# EAGLE schematic spider (EAGLE 9.6.0)
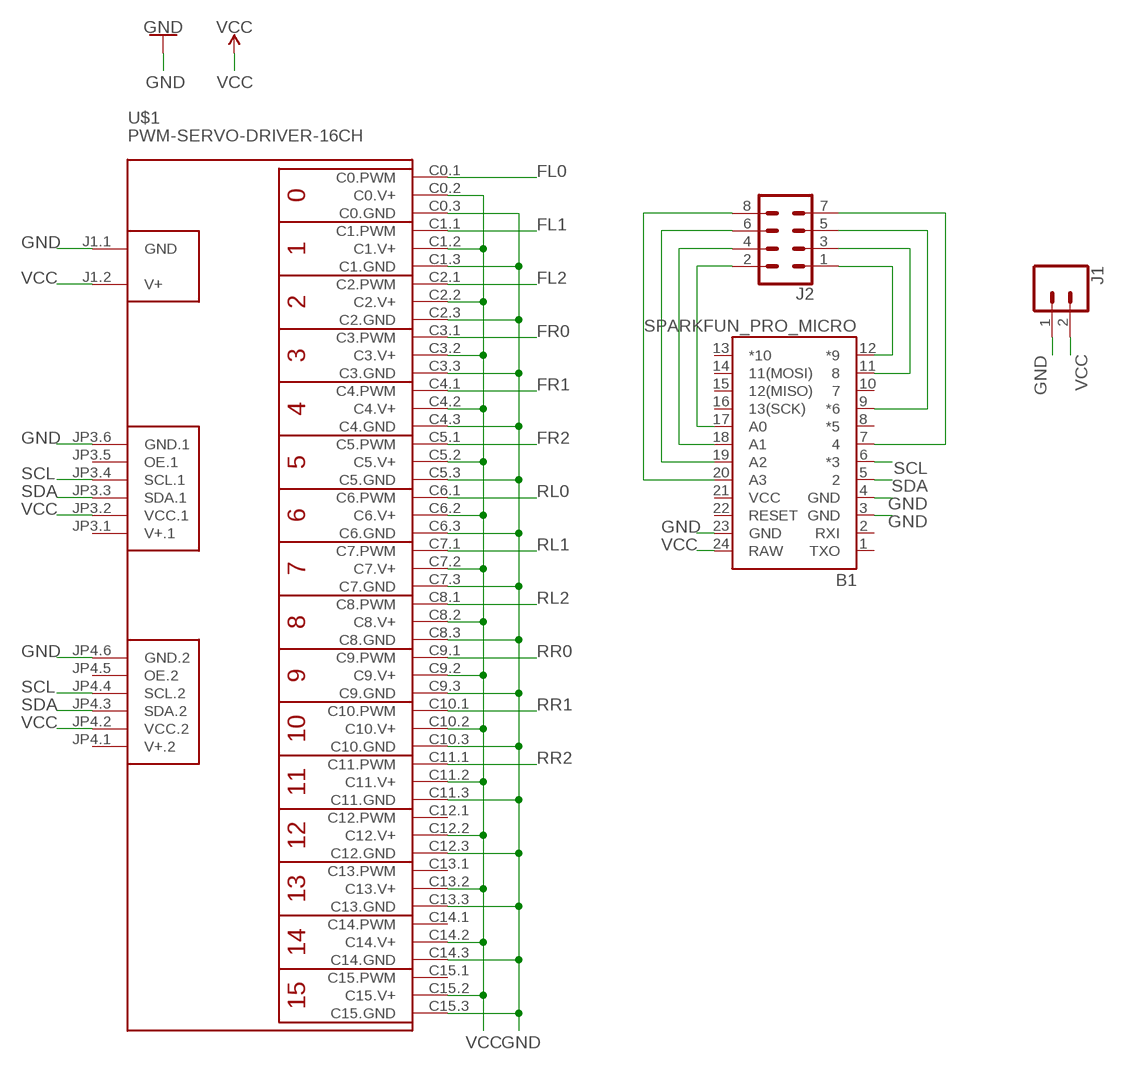
[diagram p0: schematic, sheet 1]

## Parts
B1  SPARKFUN_PRO_MICRO  [SPARKFUN_PRO_MICRO]
J1  CONN_02  [1X02]
J2  CONN_04X2  [2X4]
U$1  PWM-SERVO-DRIVER-16CH  [PWM-SERVO-DRIVER-16CH]

## Nets
FL0: U$1.C0.1(C0.PWM)
FL1: U$1.C1.1(C1.PWM)
FL2: U$1.C2.1(C2.PWM)
FR0: U$1.C3.1(C3.PWM)
FR1: U$1.C4.1(C4.PWM)
FR2: U$1.C5.1(C5.PWM)
GND: B1.3(GND) B1.4(GND) B1.23(GND) J1.1 U$1.C0.3(C0.GND) U$1.C1.3(C1.GND) U$1.C2.3(C2.GND) U$1.C3.3(C3.GND) U$1.C4.3(C4.GND) U$1.C5.3(C5.GND) U$1.C6.3(C6.GND) U$1.C7.3(C7.GND) U$1.C8.3(C8.GND) U$1.C9.3(C9.GND) U$1.C10.3(C10.GND) U$1.C11.3(C11.GND) U$1.C12.3(C12.GND) U$1.C13.3(C13.GND) U$1.C14.3(C14.GND) U$1.C15.3(C15.GND) U$1.J1.1(GND) U$1.JP3.6(GND.1) U$1.JP4.6(GND.2)
N$3: B1.17(A0) J2.2
N$4: B1.18(A1) J2.4
N$5: B1.19(A2) J2.6
N$6: B1.20(A3) J2.8
N$7: B1.12(*9) J2.1
N$8: B1.11 J2.3
N$9: B1.9(*6) J2.5
N$10: B1.7 J2.7
RL0: U$1.C6.1(C6.PWM)
RL1: U$1.C7.1(C7.PWM)
RL2: U$1.C8.1(C8.PWM)
RR0: U$1.C9.1(C9.PWM)
RR1: U$1.C10.1(C10.PWM)
RR2: U$1.C11.1(C11.PWM)
SCL: B1.6(*3) U$1.JP3.4(SCL.1) U$1.JP4.4(SCL.2)
SDA: B1.5 U$1.JP3.3(SDA.1) U$1.JP4.3(SDA.2)
VCC: B1.24(RAW) J1.2 U$1.C0.2(C0.V+) U$1.C1.2(C1.V+) U$1.C2.2(C2.V+) U$1.C3.2(C3.V+) U$1.C4.2(C4.V+) U$1.C5.2(C5.V+) U$1.C6.2(C6.V+) U$1.C7.2(C7.V+) U$1.C8.2(C8.V+) U$1.C9.2(C9.V+) U$1.C10.2(C10.V+) U$1.C11.2(C11.V+) U$1.C12.2(C12.V+) U$1.C13.2(C13.V+) U$1.C14.2(C14.V+) U$1.C15.2(C15.V+) U$1.J1.2(V+) U$1.JP3.2(VCC.1) U$1.JP4.2(VCC.2)
Unconnected: B1.1(TXO) B1.2(RXI) B1.8(*5) B1.10 B1.13(*10) B1.14(11(MOSI)) B1.15(12(MISO)) B1.16(13(SCK)) B1.22(RESET) U$1.C12.1(C12.PWM) U$1.C13.1(C13.PWM) U$1.C14.1(C14.PWM) U$1.C15.1(C15.PWM) U$1.JP3.5(OE.1) U$1.JP4.5(OE.2)

## Power pins joined to a net without a drawn wire
V+.1: U$1.JP3.1(V+.1)
V+.2: U$1.JP4.1(V+.2)
VCC: B1.21(VCC)

## Library data of the parts
B1 = SparkFun-Boards:SPARKFUN_PRO_MICRO: SparkFun Pro Micro Atmega32U4 compatible footprint. SparkFun Products: 3.3V/8MHz <https://www.sparkfun.com/products/12587> 5V/16MHz <https://www.sparkfun.com/products/12640>
J1 = SparkFun-Connectors:CONN_02: Multi connection point. Often used as Generic Header-pin footprint for 0.1 inch spaced/style header connections On any of the 0.1 inch spaced packages, you can populate with these: Break Away Headers - Straight <https://www.sparkfun.com/products/116> (PRT-00116) Break Away Male Headers - Right Angle <https://www.sparkfun.com/products/553> (PRT-00553) Female Headers <https://www.sparkfun.com/products/115> (PRT-00115) Break Away Headers - Machine Pin <https://www.sparkfun.com/products/117> (PRT-00117) Break Away Female Headers - Swiss Machine Pin <https://www.sparkfun.com/products/743> (PRT-00743) For SCREWTERMINALS and SPRING TERMINALS visit here: Screw Terimnals on SparkFun.com <https://www.sparkfun.com/search/results?term=Screw+Terminals> (5mm/3.5mm/2.54mm spacing) This device is also useful as a general connection point to wire up your design to another part of your project. Our various solder wires solder well into these plated through hole pads. Hook-Up Wire - Assortment (Stranded, 22 AWG) <https://www.sparkfun.com/products/11375> (PRT-11375) Hook-Up Wire - Assortment (Solid Core, 22 AWG) <https://www.sparkfun.com/products/11367> (PRT-11367) View the entire wire category on our website here <https://www.sparkfun.com/categories/141> Special notes: Molex polarized connector foot print use with: PRT-08233 with associated crimp pins and housings. 2.54_SCREWTERM for use with PRT-10571. 3.5mm Screw Terminal footprints for PRT-08084 5mm Screw Terminal footprints for use with PRT-08432
J2 = SparkFun-Connectors:CONN_04X2: Multi connection point. Often used as Generic Header-pin footprint for 0.1 inch spaced/style header connections On any of the 0.1 inch spaced packages, you can populate with these: Break Away Headers - Straight <https://www.sparkfun.com/products/116> (PRT-00116) Break Away Male Headers - Right Angle <https://www.sparkfun.com/products/553> (PRT-00553) Female Headers <https://www.sparkfun.com/products/115> (PRT-00115) Break Away Headers - Machine Pin <https://www.sparkfun.com/products/117> (PRT-00117) Break Away Female Headers - Swiss Machine Pin <https://www.sparkfun.com/products/743> (PRT-00743)
U$1 = diy-modules:PWM-SERVO-DRIVER-16CH: 16-Channel 12-bit PWM/Servo Driver based on PCA9685 chip PCA9685 datasheet is available here: http://www.nxp.com/documents/data_sheet/PCA9685.pdf Arduino Library for PCA9685 is available here: https://github.com/kasperskaarhoj/PCA9685-Arduino-Library Click here to find device on ebay.com <http://www.ebay.com/sch/pwm+servo+module+pca9685>